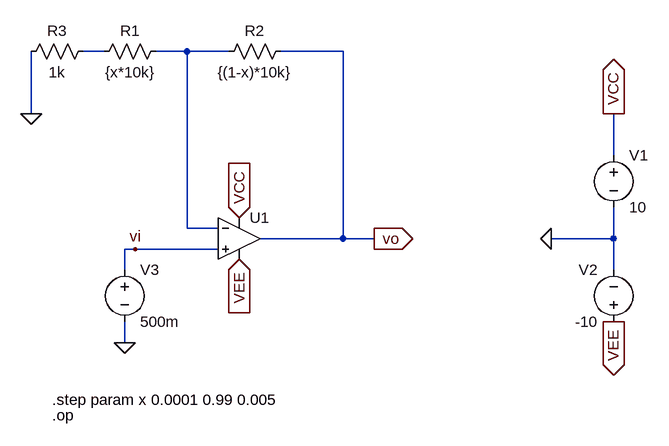
[diagram p0: schematic Lab1p2.asc]
Lab1p2.asc, the LTspice schematic file:
Version 4
SHEET 1 900 680
WIRE 32 48 0 48
WIRE 160 48 112 48
WIRE 224 48 160 48
WIRE 400 48 304 48
WIRE -80 144 -80 48
WIRE 816 208 816 144
WIRE 160 320 160 48
WIRE 208 320 160 320
WIRE 400 336 400 48
WIRE 400 336 272 336
WIRE 448 336 400 336
WIRE 816 336 816 288
WIRE 816 336 720 336
WIRE 80 352 64 352
WIRE 208 352 80 352
WIRE 64 384 64 352
WIRE 816 384 816 336
WIRE 64 496 64 464
FLAG 720 336 0
FLAG 816 144 VCC
IOPIN 816 144 Out
FLAG 816 464 VEE
IOPIN 816 464 Out
FLAG 240 368 VEE
IOPIN 240 368 In
FLAG 240 304 VCC
IOPIN 240 304 In
FLAG 64 496 0
FLAG 448 336 vo
IOPIN 448 336 Out
FLAG -80 144 0
FLAG 80 352 vi
SYMBOL res 128 32 R90
WINDOW 0 0 56 VBottom 2
WINDOW 3 32 56 VTop 2
SYMATTR InstName R1
SYMATTR Value {x*10k}
SYMBOL res 320 32 R90
WINDOW 0 0 56 VBottom 2
WINDOW 3 32 56 VTop 2
SYMATTR InstName R2
SYMATTR Value {(1-x)*10k}
SYMBOL OpAmps\\UniversalOpAmp2 240 336 R0
SYMATTR InstName U1
SYMATTR Value2 Avol=200k GBW=1.5Meg Slew=0.5Meg
SYMATTR SpiceLine Ilimit=25m Rail=1 Vos=1m
SYMATTR SpiceLine2 En=0 Enk=0 In=0 Ink=0 Rin=2Meg
SYMBOL voltage 816 192 R0
SYMATTR InstName V1
SYMATTR Value 10
SYMBOL voltage 816 480 R180
WINDOW 0 24 96 Left 2
WINDOW 3 24 16 Left 2
SYMATTR InstName V2
SYMATTR Value -10
SYMBOL voltage 64 368 R0
WINDOW 123 0 0 Left 0
WINDOW 39 0 0 Left 0
SYMATTR InstName V3
SYMATTR Value 500m
SYMBOL res 16 32 R90
WINDOW 0 0 56 VBottom 2
WINDOW 3 32 56 VTop 2
SYMATTR InstName R3
SYMATTR Value 1k
TEXT -48 584 Left 2 !.step param x 0.0001 0.99 0.005
TEXT -48 608 Left 2 !.op

The netlist it stands for:
* Lab1p2.asc
R1 N002 N001 {x*10k}
R2 vo N002 {(1-x)*10k}
XU1 vi N002 VCC VEE vo level2 Avol=200k GBW=1.5Meg Slew=0.5Meg Ilimit=25m Rail=1 Vos=1m En=0 Enk=0 In=0 Ink=0 Rin=2Meg  ; pins In+ In- V+ V- OUT
V1 VCC 0 10
V2 VEE 0 -10
V3 vi 0 500m
R3 N001 0 1k
.step param x 0.0001 0.99 0.005
.op
.lib UniversalOpAmp2.lib
.backanno
.end